# EAGLE design Pacman2 (EAGLE 9.2.2)
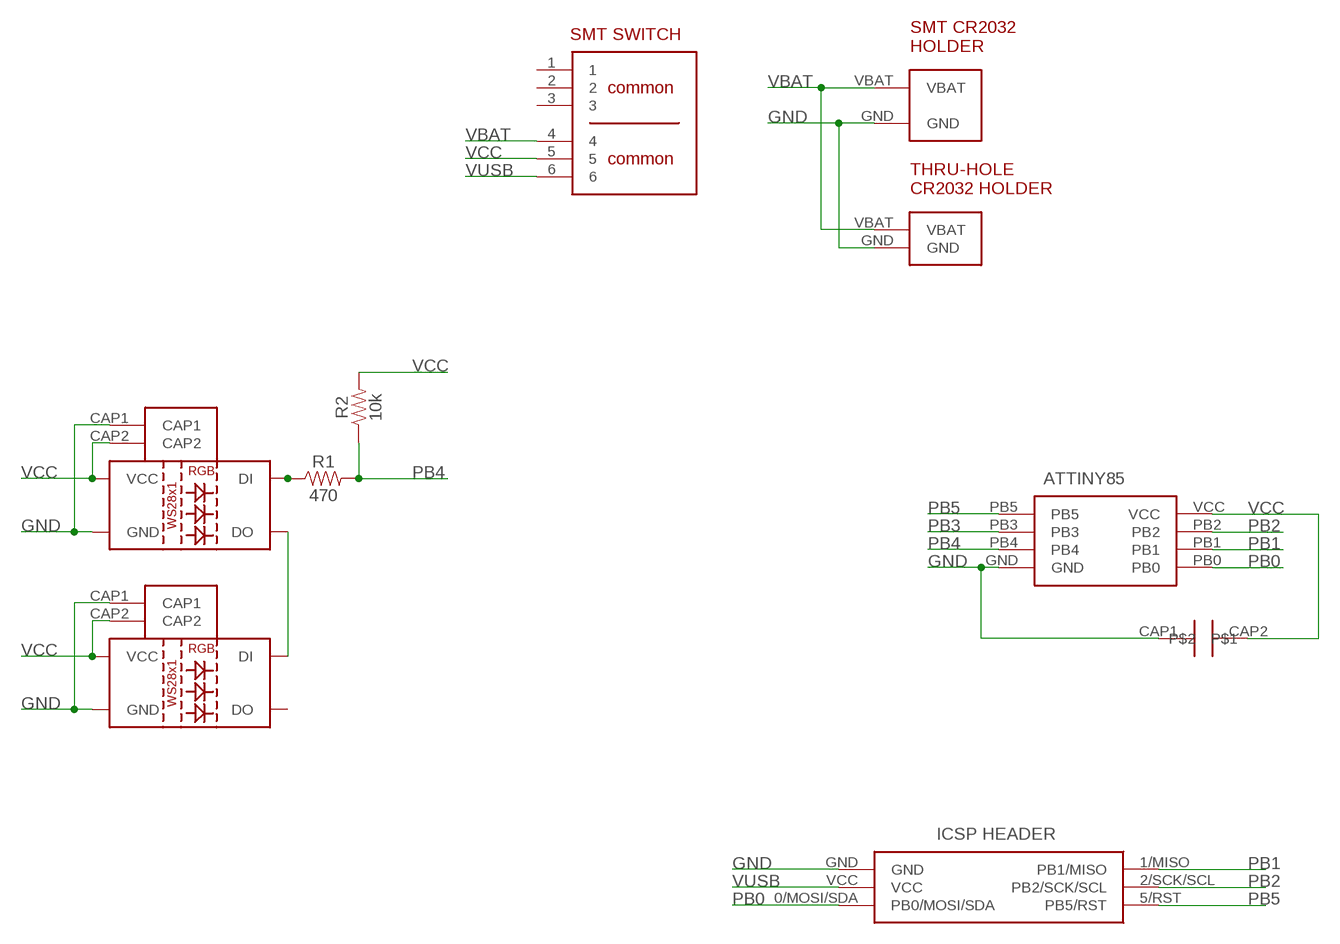
[diagram p0: schematic, sheet 1]

## Parts
D1  WS2812B  [WS2812B]
D2  WS2812B  [WS2812B]
DECOUPLER  .1uf  0603-CAP  [0603-CAP]
IC1  ATTINY85-20SU  [SOT127P798X216-8N]
J2  ICSP-LO-SILK  [ICSP-LO-SILK]
R1  470  470OHM-0603-1/10W-1%  [0603]
R2  10k  10KOHM-0603-1/10W-1%  [0603]
U$2  SMT-BATTERY-HOLDER  [SMT-CR-HOLDER]
U$3  THRU-CR-HOLDER  [THRU-CR-HOLDER]
U$145  SMT-SWITCH  [SMT-SWITCH]

## Nets
GND [GND]: D1.CAP1 D1.GND D2.CAP1 D2.GND DECOUPLER.CAP1 IC1.GND J2.GND U$2.GND U$3.GND
N$3: D1.DO D2.DI
N$5: D1.DI R1.1
PB0: IC1.PB0 J2.0/MOSI/SDA(PB0/MOSI/SDA)
PB1: IC1.PB1 J2.1/MISO(PB1/MISO)
PB2: IC1.PB2 J2.2/SCK/SCL(PB2/SCK/SCL)
PB3: IC1.PB3
PB4: IC1.PB4 R1.2 R2.1
PB5: IC1.PB5 J2.5/RST(PB5/RST)
VBAT [VBAT]: U$2.VBAT U$3.VBAT U$145.4
VCC [VCC]: D1.CAP2 D1.VCC D2.CAP2 D2.VCC DECOUPLER.CAP2 IC1.VCC R2.2 U$145.5
VUSB: J2.VCC U$145.6
Unconnected: D2.DO U$145.1 U$145.2 U$145.3

## Library data of the parts
D1 D2 = BadgeParts:WS2812B: WS2812B SMD addressable RGB LED 5x5mm SMD LED with built-in controller IC. Color: Red/Green/Blue mC Rating: RGB: 390, 660, 180 mcd Forward Voltage: RGB: 2.0, 3.0, 3.0 V Packages:WS2812B SparkFun Products: Blynk Board - ESP8266 <https://www.sparkfun.com/products/13794>; PROD_ID: DIO-12503
DECOUPLER = BadgeParts:0603-CAP
IC1 = BadgeParts:ATTINY85-20SU: MICROCHIP - ATTINY85-20SU - MICROCONTROLLER MCU, 8 BIT, ATTINY, 20MHZ, SOIC-8 Source: Datasheet <https://componentsearchengine.com/Datasheets/2/ATTINY85-20SU.pdf>; ARROW_PART_NUMBER: ATTINY85-20SU; ARROW_PRICE/STOCK: https://www.arrow.com/en/products/attiny85-20su/microchip-technology; DESCRIPTION: MICROCHIP - ATTINY85-20SU - MICROCONTROLLER MCU, 8 BIT, ATTINY, 20MHZ, SOIC-8; HEIGHT: 2.16mm; MANUFACTURER_NAME: Microchip; MANUFACTURER_PART_NUMBER: ATTINY85-20SU; RS_PART_NUMBER: 1331674; RS_PRICE/STOCK: http://uk.rs-online.com/web/p/products/1331674
J2 = BadgeParts:ICSP-LO-SILK: 03+03 DIL Vertical Pin Header HARWIN M20 Series, 2.54mm Pitch 6 Way 2 Row Straight PCB Header, Solder Termination, 3A Source: Datasheet <https://cdn.harwin.com/pdfs/M20-998.pdf?utm_source=3D_PDF&utm_medium=3D_PDF&utm_campaign=3D_PDF>
R1 = SparkFun-Resistors:470OHM: 470Ω resistor A resistor is a passive two-terminal electrical component that implements electrical resistance as a circuit element. Resistors act to reduce current flow, and, at the same time, act to lower voltage levels within circuits. - Wikipedia; PROD_ID: RES-07869
R2 = SparkFun-Resistors:10KOHM: 10kΩ resistor A resistor is a passive two-terminal electrical component that implements electrical resistance as a circuit element. Resistors act to reduce current flow, and, at the same time, act to lower voltage levels within circuits. - Wikipedia; PROD_ID: RES-00824
U$2 = BadgeParts:SMT-BATTERY-HOLDER
U$3 = BadgeParts:THRU-CR-HOLDER
U$145 = BadgeParts:SMT-SWITCH

## Net classes
0 default: width 0.254 mm, clearance 0.254 mm
1 VCC: width 0.381 mm, clearance 0.254 mm
2 GND: width 0.381 mm, clearance 0.254 mm
3 VBAT: width 0.381 mm, clearance 0.254 mm

## Board
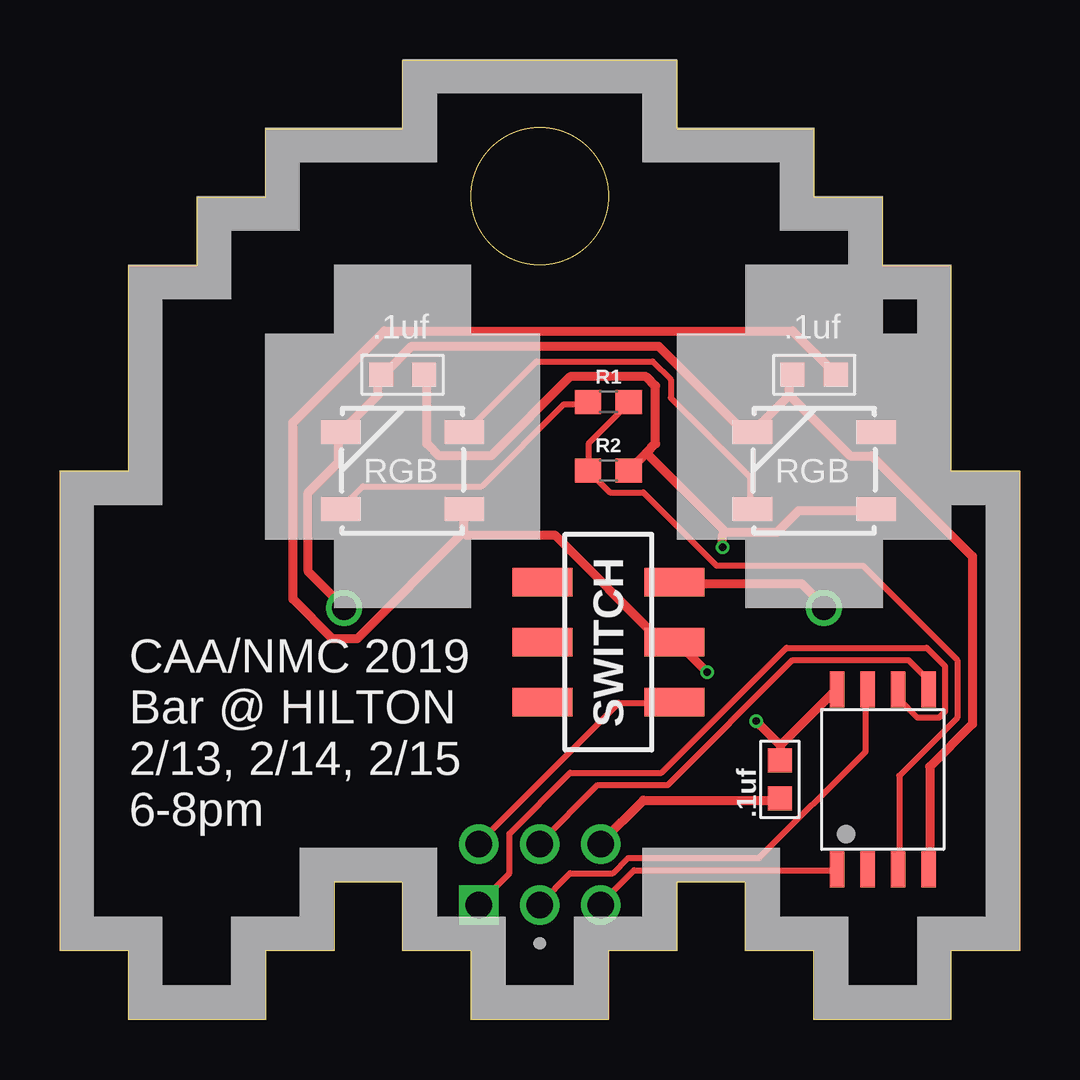
[diagram p1: board, top side]
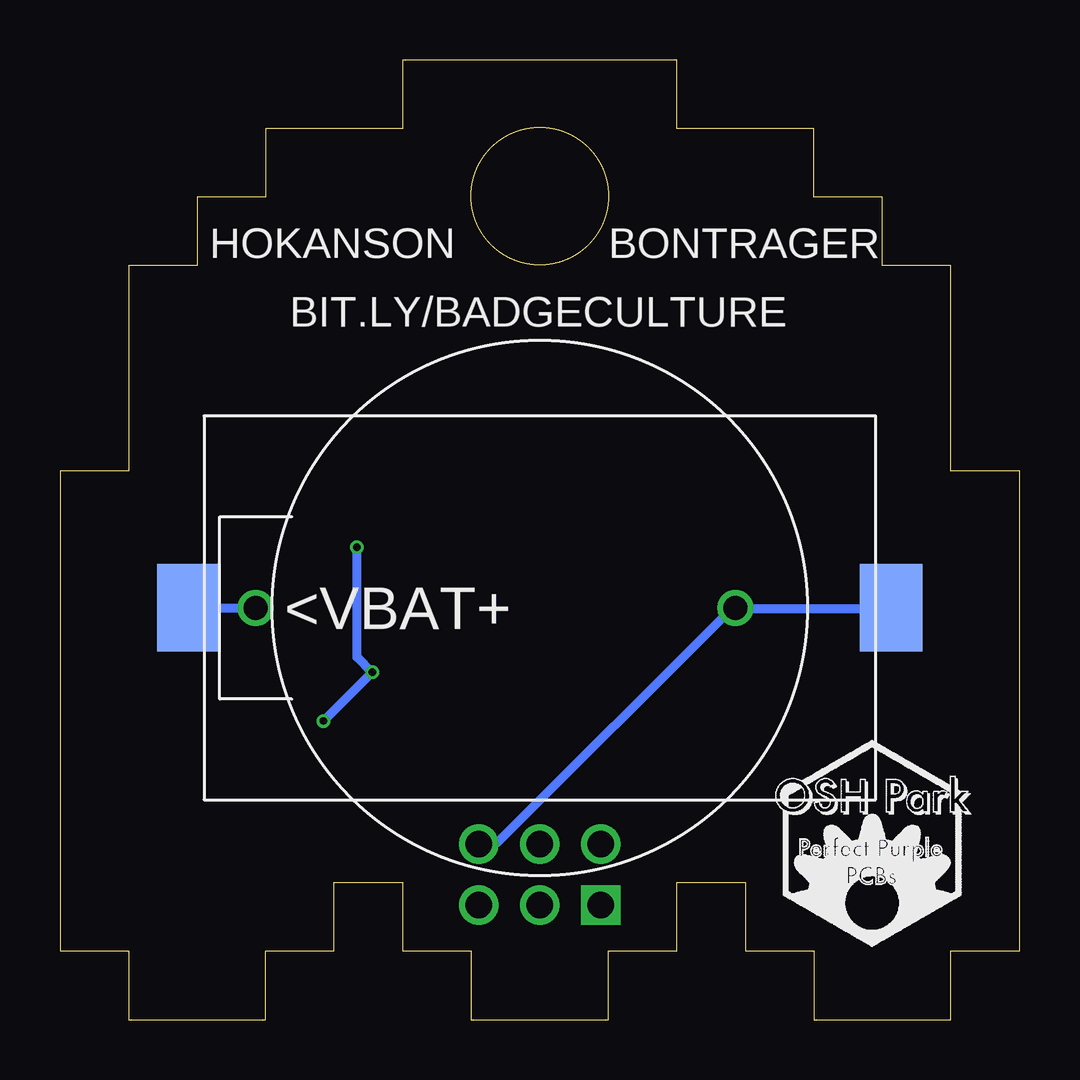
[diagram p2: board, bottom side, seen from below]

Size 40 x 40 mm. Coordinates in mm from the lower left corner, seen from the top.
Outline: 40,2.86 37.14,2.86 37.14,0 31.43,0 31.43,2.86 28.57,2.86 28.57,5.71 25.71,5.71 25.71,2.86 22.86,2.86 22.86,0 17.14,0 17.14,2.86 14.29,2.86 14.29,5.71 11.43,5.71 11.43,2.86 8.57,2.86 8.57,0 2.86,0 2.86,2.86 0,2.86 0,22.86 2.86,22.86 2.86,31.43 5.71,31.43 5.71,34.29 8.57,34.29 8.57,37.14 14.29,37.14 14.29,40 25.71,40 25.71,37.14 31.43,37.14 31.43,34.29 34.29,34.29 34.29,31.43 37.14,31.43 37.14,22.86 40,22.86 40,2.86
Outline: circle at 20,34.32 radius 2.86
Copper layers (1*16): Top 0.035559375mm / dielectric 1.6mm / Bottom 0.035559375mm
Design rules "oshpark-2layer": minimum track width 6mil, minimum drill 10mil, track to track 6mil, track to pad 6mil, pad to pad 6mil, via to via 6mil, smd to smd 6mil, copper to edge 15mil, drill to drill 6mil, minimum pad ring 5mil, minimum via ring 5mil, stop-mask expansion 2.5mil, vias tented up to drill 0mil, thermal gap 10mil

### Footprints (pad centres in the part's own frame; a part is rotated, then mirrored left to right if it is on the bottom)
WS2812B = smd 1 x 1: CAP1 -0.9,4; CAP2 0.9,4 | smd 1.651 x 1: DI -2.577,-1.6; DO 2.577,1.6; GND -2.577,1.6; VCC 2.577,-1.6
0603-CAP = smd 1 x 1: CAP1 -0.8,0; CAP2 0.8,0
SOT127P798X216-8N = smd 1.5 x 0.6: GND -3.75,-1.905; PB0 3.75,-1.905; PB1 3.75,-0.635; PB2 3.75,0.635; PB3 -3.75,0.635; PB4 -3.75,-0.635; PB5 -3.75,1.905; VCC 3.75,1.905
ICSP-LO-SILK = drill 1.1 pad 1.65: 0/MOSI/SDA 0,1.27; 2/SCK/SCL 0,3.81; 5/RST -2.54,3.81; GND -2.54,1.27; VCC 2.54,1.27 | drill 1.1 pad 1.65 square: 1/MISO 2.54,3.81
0603 = smd 1.1 x 1: 1 -0.85,0; 2 0.85,0
SMT-CR-HOLDER = smd 2.6 x 3.65: GND 14.65,0; VBAT -14.65,0
THRU-CR-HOLDER = drill 1: GND 8.15,0; VBAT -11.85,0
SMT-SWITCH = smd 1.2 x 2.5: 1 -2.5,-2.75; 2 0,-2.75; 3 2.5,-2.75; 4 -2.5,2.75; 5 0,2.75; 6 2.5,2.75

### Placement (x,y rotation side)
D1  14.28,22.88 0 top
D2  31.44,22.88 0 top
DECOUPLER  30.01,10.01 90 top
IC1  34.3,10.01 90 top
J2  20,8.58 180 top
R1  22.86,25.74 0 top
R2  22.86,22.88 0 top
U$2  20,17.16 0 bottom
U$3  20,17.16 0 bottom
U$5  [OSHPARK_LOGOHEX]  10.26,2.98 0 bottom
U$145  22.86,15.73 270 top

### Tracks (layer width: path | path; a pad name or v marks a point on that pad's centre or on a via)
GND
  Top 0.381: 30.41,26.04 30.41,26.8 D2.CAP1 | 30.41,26.04 28.89,24.51 D2.GND 28.76,24.64 28.38,24.64 24.95,28.07 14.67,28.07 13.52,26.92 D1.CAP1 13.27,26.8 13.27,26.04 11.74,24.51 D1.GND 11.62,24.38 11.62,23.24 10.35,21.97 10.35,18.67 11.74,17.27 U$3.GND | 30.41,26.04 32.95,23.5 33.84,23.5 38.03,19.3 38.03,12.32 36.26,10.54 36.26,6.35 IC1.GND | DECOUPLER.CAP1 29.91,9.14 24.32,9.14 22.54,7.37 J2.GND
  Bottom 0.381: U$2.GND 5.39,17.14 11.74,17.14 U$3.GND 12,17.14 21.78,7.37 22.54,7.37 J2.GND
N$3
  Top 0.254: D2.DI 28.76,21.34 28.76,22.61 25.46,25.91 25.46,26.67 24.7,27.43 19.87,27.43 16.95,24.51 D1.DO
N$5
  Top 0.254: R1.1 21.91,25.65 21.02,25.65 17.59,22.23 12.63,22.23 11.74,21.34 D1.DI
PB0
  Top 0.254: IC1.PB0 36.13,13.84 36.13,14.22 35.37,14.99 30.54,14.99 25.33,9.78 22.41,9.78 20,7.37 J2.0/MOSI/SDA
PB1
  Top 0.254: IC1.PB1 34.99,13.72 34.99,13.34 35.75,12.57 36.64,12.57 36.89,12.83 36.89,14.73 36.13,15.49 30.29,15.49 25.08,10.29 21.27,10.29 18.73,7.75 18.73,6.1 17.46,4.83 J2.1/MISO
PB2
  Top 0.254: IC1.PB2 33.59,13.72 33.59,11.18 29.14,6.73 23.68,6.73 23.05,6.1 21.27,6.1 20,4.83 J2.2/SCK/SCL
PB4
  Top 0.254: R1.2 23.68,25.65 22.03,24 22.03,22.99 R2.1 22.03,22.86 22.92,21.97 24.32,21.97 27.37,18.92 33.46,18.92 37.4,14.99 37.4,12.57 34.99,10.16 34.99,6.35 IC1.PB4
PB5
  Top 0.254: IC1.PB5 32.32,6.22 23.94,6.22 22.54,4.83 J2.5/RST
VBAT
  Top 0.381: U$145.4 25.71,18.16 30.92,18.16 31.81,17.27 U$3.VBAT
  Bottom 0.381: U$2.VBAT 34.61,17.14 31.94,17.14 U$3.VBAT
VCC  (via drill 0.3)
  Top 0.381: 24.45,23.62 23.81,22.99 R2.2 | 24.45,23.62 24.83,24 24.83,26.42 24.45,26.8 21.27,26.8 17.97,23.5 15.81,23.5 15.3,24 15.3,26.8 D1.CAP2 | 27.75,20.32 29.91,20.32 30.8,21.21 33.97,21.21 D2.VCC | 24.45,23.62 27.75,20.32 | 30.03,11.43 30.03,10.92 DECOUPLER.CAP2 | 30.03,11.43 32.32,13.72 IC1.VCC | 16.82,20.32 12.38,15.88 11.36,15.88 9.71,17.53 9.71,24.89 13.52,28.7 30.54,28.7 32.32,26.92 D2.CAP2 | 16.82,20.32 16.82,21.21 D1.VCC | 16.82,20.32 16.95,20.19 20.64,20.19 25.08,15.75 25.59,15.75 U$145.5 25.71,15.75 v26.98,14.48 | v29.02,12.45 30.03,11.43 | v27.62,19.68 27.62,20.19 27.75,20.32
  Bottom 0.381: v29.02,12.45 v26.98,14.48 27.62,15.11 v27.62,19.68
VUSB
  Top 0.254: U$145.6 25.59,13.21 23.3,13.21 17.46,7.37 J2.VCC

### Text on the board
tPlace: CAA/NMC 2019 / Bar @ HILTON / 2/13, 2/14, 2/15 / 6-8pm
bPlace: BONTRAGER | HOKANSON | BIT.LY/BADGECULTURE